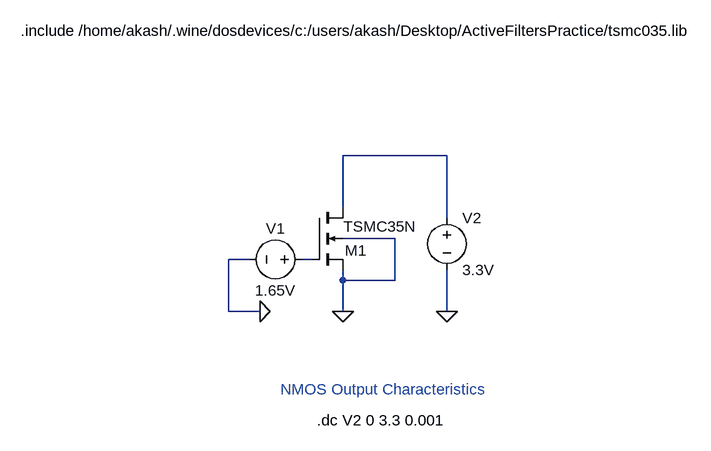
[diagram p0: schematic NMOS_Output_characteristics.asc]
NMOS_Output_characteristics.asc, the LTspice schematic file:
Version 4
SHEET 1 1052 680
WIRE 544 208 384 208
WIRE 384 288 384 208
WIRE 544 304 544 208
WIRE 464 336 384 336
WIRE 240 368 208 368
WIRE 336 368 320 368
WIRE 384 400 384 384
WIRE 464 400 464 336
WIRE 464 400 384 400
WIRE 208 448 208 368
WIRE 256 448 208 448
WIRE 384 448 384 400
WIRE 544 448 544 384
FLAG 256 448 0
FLAG 384 448 0
FLAG 544 448 0
SYMBOL nmos4 336 288 R0
WINDOW 0 51 66 Left 2
WINDOW 3 49 29 Left 2
SYMATTR InstName M1
SYMATTR Value TSMC35N
SYMATTR Value2 l=0.5u w=5u
SYMBOL voltage 336 368 R90
WINDOW 0 -32 56 VBottom 2
WINDOW 3 32 56 VTop 2
SYMATTR InstName V1
SYMATTR Value 1.65V
SYMBOL voltage 544 288 R0
SYMATTR InstName V2
SYMATTR Value 3.3V
TEXT -112 16 Left 2 !.include /home/akash/.wine/dosdevices/c:/users/akash/Desktop/ActiveFiltersPractice/tsmc035.lib
TEXT 344 616 Left 2 !.dc V2 0 3.3 0.001
TEXT 288 568 Left 2 ;NMOS Output Characteristics

The netlist it stands for:
* NMOS_Output_characteristics.asc
M1 N001 N002 0 0 TSMC35N l=0.5u w=5u
V1 N002 0 1.65V
V2 N001 0 3.3V
.model NMOS NMOS
.model PMOS PMOS
.lib standard.mos
.include /home/akash/.wine/dosdevices/c:/users/akash/Desktop/ActiveFiltersPractice/tsmc035.lib
.dc V2 0 3.3 0.001
* NMOS Output Characteristics
.backanno
.end